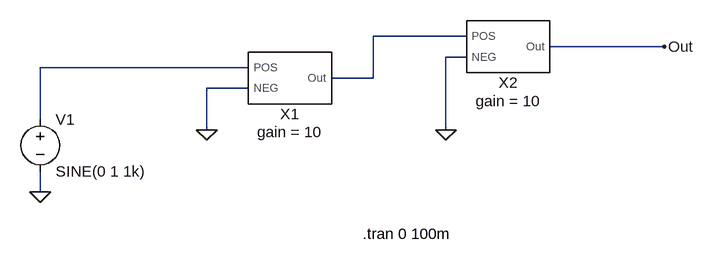
[diagram p0: schematic Part_Circuit.asc]
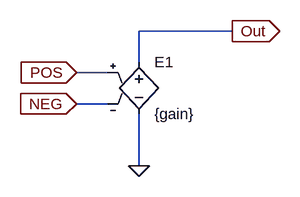
[diagram p1: sub-circuit draft5.asc]
Part_Circuit.asc, the LTspice schematic file:
Version 4.1
SHEET 1 892 680
WIRE 528 112 384 112
WIRE 832 128 656 128
WIRE 528 144 496 144
WIRE 192 160 -128 160
WIRE 384 176 384 112
WIRE 384 176 320 176
WIRE 192 192 128 192
WIRE -128 240 -128 160
WIRE 128 256 128 192
WIRE 496 256 496 144
WIRE -128 352 -128 320
FLAG 128 256 0
FLAG 496 256 0
FLAG -128 352 0
FLAG 832 128 Out
SYMBOL Draft5 256 176 M180
WINDOW 39 0 -68 Bottom 2
SYMATTR InstName X1
SYMATTR SpiceLine gain = 10
SYMBOL Draft5 592 128 M180
WINDOW 39 0 -68 Bottom 2
SYMATTR InstName X2
SYMATTR SpiceLine gain = 10
SYMBOL voltage -128 224 R0
WINDOW 123 0 0 Left 0
WINDOW 39 0 0 Left 0
SYMATTR InstName V1
SYMATTR Value SINE(0 1 1k)
TEXT 368 416 Left 2 !.tran 0 100m

draft5.asc, the sub-circuit schematic file:
Version 4.1
SHEET 1 880 680
WIRE 384 48 240 48
WIRE 240 96 240 48
WIRE 192 112 144 112
WIRE 192 160 144 160
WIRE 240 256 240 176
FLAG 144 112 POS
IOPIN 144 112 In
FLAG 144 160 NEG
IOPIN 144 160 In
FLAG 240 256 0
FLAG 384 48 Out
IOPIN 384 48 Out
SYMBOL e 240 80 R0
SYMATTR InstName E1
SYMATTR Value {gain}

The netlist it stands for:
* Part_Circuit.asc
X§X1 0 N002 N001 draft5 params: gain = 10
X§X2 0 N001 Out draft5 params: gain = 10
V1 N002 0 SINE(0 1 1k)

* block symbol definitions
.subckt draft5 NEG POS Out
E1 Out 0 POS NEG {gain}
.ends draft5

.tran 0 100m
.backanno
.end